# EAGLE design Prototype1 (EAGLE 9.5.2)
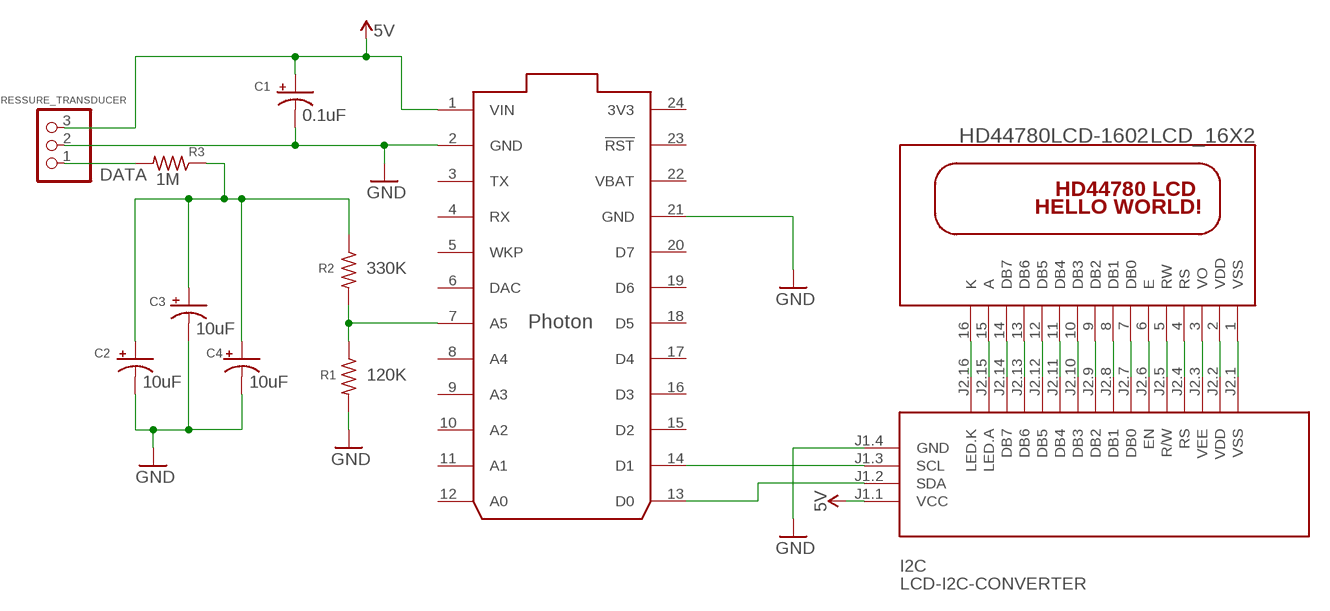
[diagram p0: schematic, sheet 1]

## Parts
C1  0.1uF  CPOL-USE2.5-7  [E2,5-7]
C2  10uF  CPOL-USE2.5-5  [E2,5-5]
C3  10uF  CPOL-USE2.5-5  [E2,5-5]
C4  10uF  CPOL-USE2.5-5  [E2,5-5]
I2C  LCD-I2C-CONVERTER  [LCD-I2C-CONVERTER]
LCD_16X2  HD44780LCD-1602  [LCD1602]
PHOTON  PHOTON_WITH_HEADERS  [PHOTON]
PRESSURE_TRANSDUCER  PINHD-1X3  [1X03]
R1  120K  R-US_0207/10  [0207/10]
R2  330K  R-US_0207/10  [0207/10]
R3  1M  R-US_0207/10  [0207/10]

## Nets
5V: C1.+ I2C.J1.1(VCC) PHOTON.1(VIN) PRESSURE_TRANSDUCER.3
DATA: C2.+ C3.+ C4.+ R2.1 R3.1
GND: C1.- C2.- C3.- C4.- I2C.J1.4(GND) PHOTON.2(GND) PHOTON.21(GND) PRESSURE_TRANSDUCER.2 R1.2
N$1: PHOTON.7(A5) R1.1 R2.2
N$3: I2C.J2.4(RS) I2C.J2.14(DB7) LCD_16X2.4(RS) LCD_16X2.14(DB7)
N$4: I2C.J2.5(R/W) I2C.J2.15(LED.A) LCD_16X2.5(RW) LCD_16X2.15(A)
N$5: I2C.J2.3(VEE) LCD_16X2.3(VO)
N$6: I2C.J2.7(DB0) LCD_16X2.7(DB0)
N$7: I2C.J2.8(DB1) LCD_16X2.8(DB1)
N$8: I2C.J2.9(DB2) LCD_16X2.9(DB2)
N$9: I2C.J2.10(DB3) LCD_16X2.10(DB3)
N$10: I2C.J2.11(DB4) LCD_16X2.11(DB4)
N$11: I2C.J2.12(DB5) LCD_16X2.12(DB5)
N$12: I2C.J2.13(DB6) LCD_16X2.13(DB6)
N$13: I2C.J2.16(LED.K) LCD_16X2.16(K)
N$14: I2C.J2.6(EN) LCD_16X2.6(E)
N$15: I2C.J1.2(SDA) PHOTON.13(D0)
N$17: I2C.J1.3(SCL) PHOTON.14(D1)
N$18: PRESSURE_TRANSDUCER.1 R3.2
VDD: I2C.J2.2(VDD) LCD_16X2.2(VDD)
VSS: I2C.J2.1(VSS) LCD_16X2.1(VSS)
Unconnected: PHOTON.3(TX) PHOTON.4(RX) PHOTON.5(WKP) PHOTON.6(DAC) PHOTON.8(A4) PHOTON.9(A3) PHOTON.10(A2) PHOTON.11(A1) PHOTON.12(A0) PHOTON.15(D2) PHOTON.16(D3) PHOTON.17(D4) PHOTON.18(D5) PHOTON.19(D6) PHOTON.20(D7) PHOTON.23(!RST)

## Power pins joined to a net without a drawn wire
3V3: PHOTON.24(3V3)
VBAT: PHOTON.22(VBAT)

## Library data of the parts
C1-C4 = adafruit:CPOL-US: POLARIZED CAPACITOR, American symbol
I2C = diy-modules:LCD-I2C-CONVERTER: I2C Bus to 4-Bit Parallel LCD Interface with LED backlight driver
LCD_16X2 = adafruit:HD44780LCD: HD44780 LCD Standard character type LCDs, available in sizes from 8x1 to 40x4!
PHOTON = Particle-Devices:PHOTON: Particle Photon Wi-Fi through-hole development board footprint Product datasheet: here <https://docs.particle.io/datasheets/photon-(wifi)/photon-datasheet/> Design files: here <https://github.com/particle-iot/photon> Github : Particle devices library <https://github.com/particle-iot/hardware-libraries/tree/master/Eagle>
PRESSURE_TRANSDUCER = adafruit:PINHD-1X3: PIN HEADER
R1-R3 = adafruit:R-US_: RESISTOR, American symbol

## Board
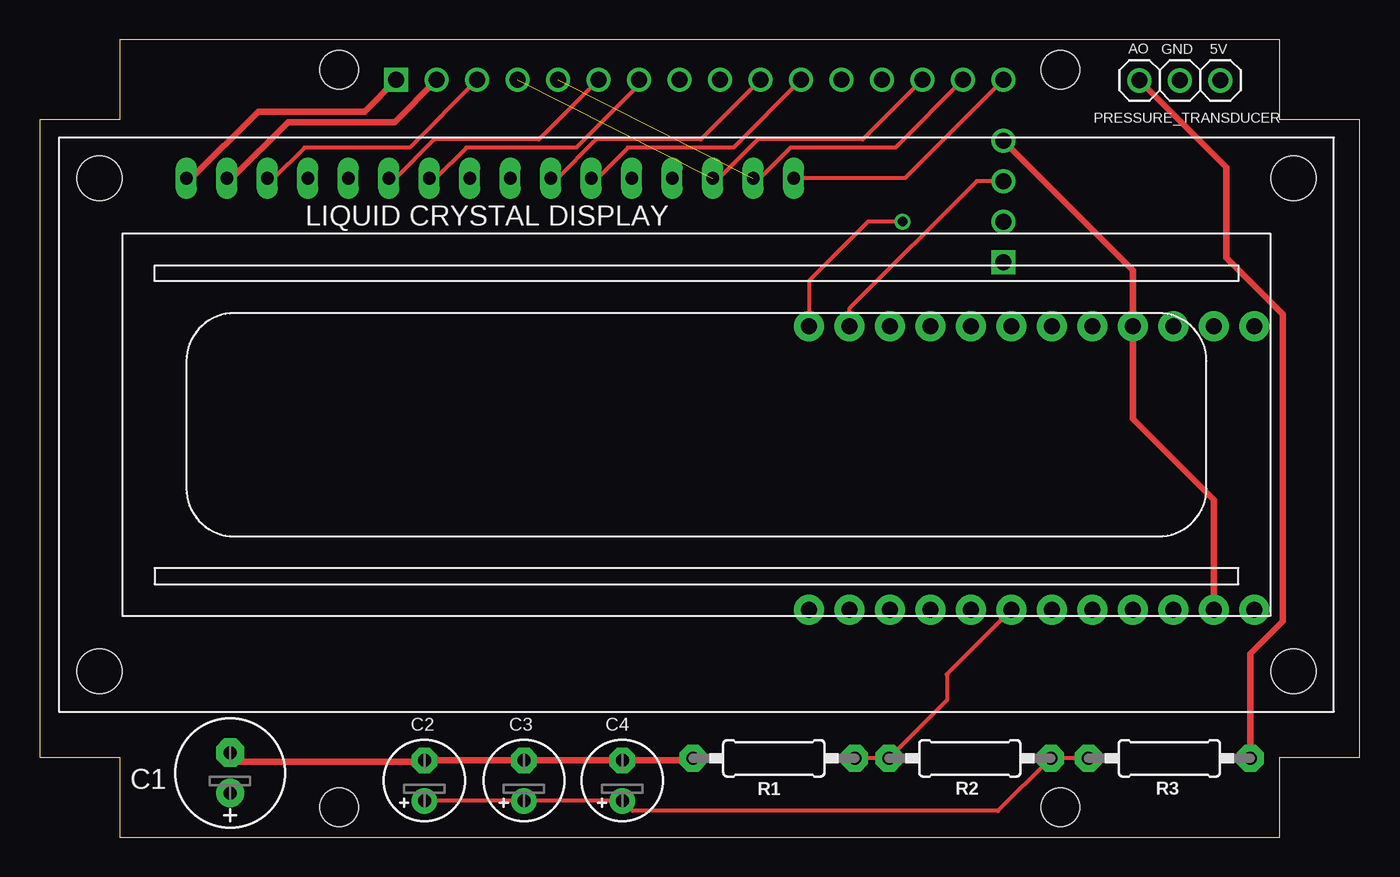
[diagram p1: board, top side]
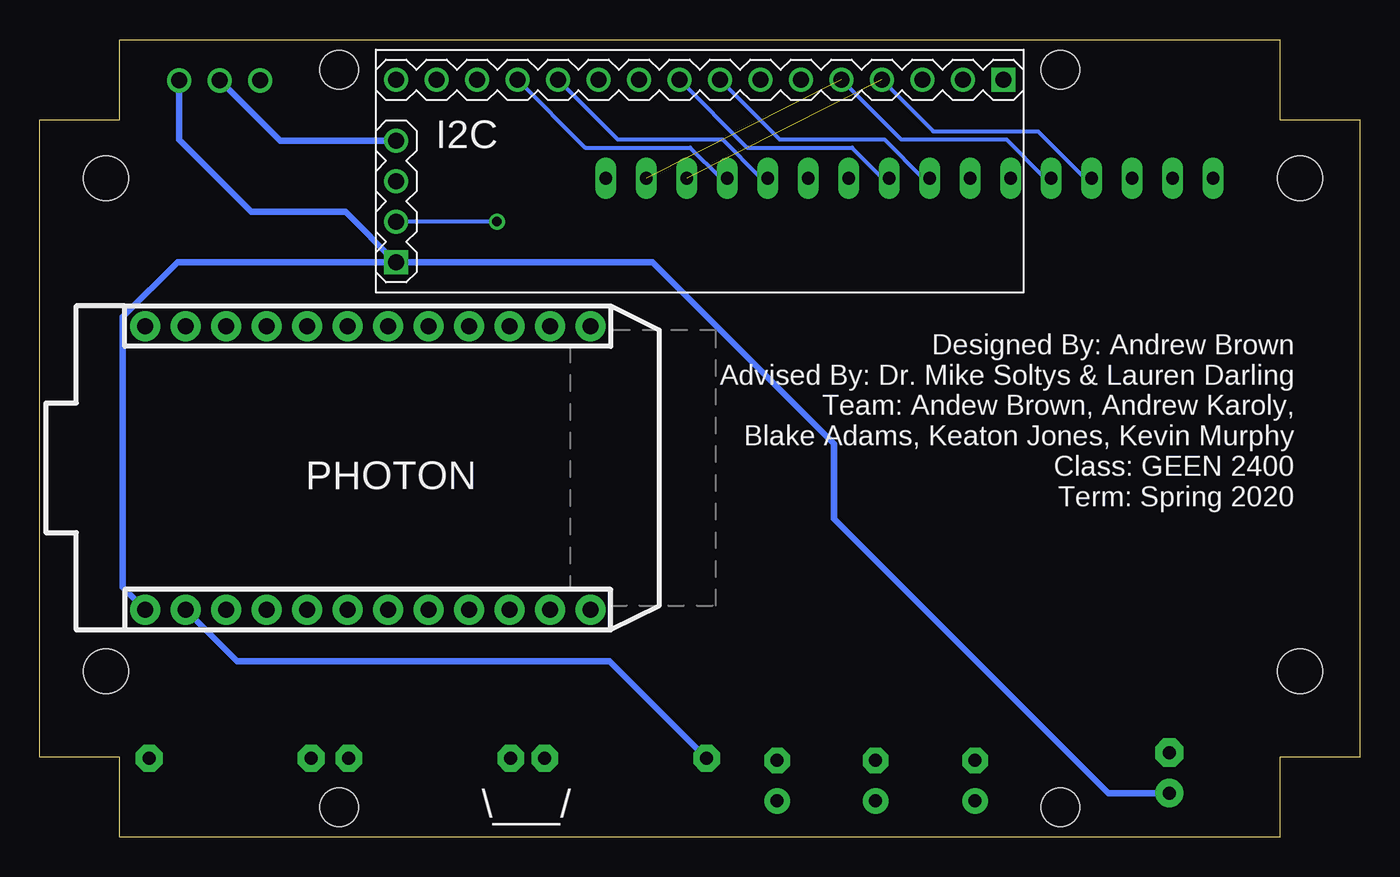
[diagram p2: board, bottom side, seen from below]

Size 82.8 x 50 mm. Coordinates in mm from the lower left corner, seen from the top.
Outline: 82.8,5 82.8,45 77.8,45 77.8,50 5,50 5,45 0,45 0,5.01 5,5.01 5,0 77.8,0 77.8,5 82.8,5
Copper layers (1*16): Top 0.035mm / dielectric 1.5mm / Bottom 0.035mm
Design rules "default *": minimum track width 10mil, minimum drill 0.6mm, track to track 10mil, track to pad 10mil, pad to pad 10mil, via to via 10mil, smd to smd 10mil, copper to edge 40mil, drill to drill 6mil, minimum pad ring 10mil, minimum via ring 8mil, stop-mask expansion 4mil, vias tented up to drill 0mil, thermal gap 10mil
Holes 2.41 mm at 18.79,1.88 18.79,48.11 64.02,48.11 64.02,1.88

### Footprints (pad centres in the part's own frame; a part is rotated, then mirrored left to right if it is on the bottom)
E2,5-7 = drill 0.813 pad 1.778: + -1.27,0 | drill 0.813 pad 1.778 octagon: - 1.27,0
E2,5-5 = drill 0.813 pad 1.6: + -1.27,0 | drill 0.813 pad 1.6 octagon: - 1.27,0
LCD-I2C-CONVERTER = drill 1 square: J1.1 -19.05,-5.08; J2.1 19.05,6.35 | drill 1: J1.2 -19.05,-2.54; J1.3 -19.05,0; J1.4 -19.05,2.54; J2.2 16.51,6.35; J2.3 13.97,6.35; J2.4 11.43,6.35; J2.5 8.89,6.35; J2.6 6.35,6.35; J2.7 3.81,6.35; J2.8 1.27,6.35; J2.9 -1.27,6.35; J2.10 -3.81,6.35; J2.11 -6.35,6.35; J2.12 -8.89,6.35; J2.13 -11.43,6.35; J2.14 -13.97,6.35; J2.15 -16.51,6.35; J2.16 -19.05,6.35
LCD1602 = drill 0.8 long: 1 8,33.46; 2 10.54,33.46; 3 13.08,33.46; 4 15.62,33.46; 5 18.16,33.46; 6 20.7,33.46; 7 23.24,33.46; 8 25.78,33.46; 9 28.32,33.46; 10 30.86,33.46; 11 33.4,33.46; 12 35.94,33.46; 13 38.48,33.46; 14 41.02,33.46; 15 43.56,33.46; 16 46.1,33.46 | hole 2.8: 2.54,2.54; 2.54,33.46; 77.46,33.46; 77.46,2.54
PHOTON = drill 1.016 pad 1.88: 1 1.27,33.02; 2 1.27,30.48; 3 1.27,27.94; 4 1.27,25.4; 5 1.27,22.86; 6 1.27,20.32; 7 1.27,17.78; 8 1.27,15.24; 9 1.27,12.7; 10 1.27,10.16; 11 1.27,7.62; 12 1.27,5.08; 13 19.05,5.08; 14 19.05,7.62; 15 19.05,10.16; 16 19.05,12.7; 17 19.05,15.24; 18 19.05,17.78; 19 19.05,20.32; 20 19.05,22.86; 21 19.05,25.4; 22 19.05,27.94; 23 19.05,30.48; 24 19.05,33.02
1X03 = drill 1.016: 1 -2.54,0; 2 0,0; 3 2.54,0
0207/10 = drill 0.813 pad 1.676 octagon: 1 -5.08,0; 2 5.08,0

### Placement (x,y rotation side)
C1  11.94,4.03 90 top
C2  24.13,3.54 90 top
C3  30.38,3.54 90 top
C4  36.55,3.54 90 top
I2C  41.4,41.14 0 bottom
LCD_16X2  1.19,7.86 0 top
PHOTON  43.18,12.99 90 bottom
PRESSURE_TRANSDUCER  71.53,47.46 0 top
R1  46.05,4.94 180 top
R2  58.34,4.94 180 top
R3  70.87,4.94 0 top

### Tracks (layer width: path | path; a pad name or v marks a point on that pad's centre or on a via)
5V
  Bottom 0.406: I2C.J1.1 44.76,36.05 44.75,36.05 44.36,36.05 32.99,24.68 32.99,19.98 15.77,2.76 C1.+ | PHOTON.1 77.6,15.66 77.6,32.62 74.16,36.05 I2C.J1.1 | PRESSURE_TRANSDUCER.3 74.07,43.73 69.55,39.2 63.63,39.2 60.48,36.05 I2C.J1.1
DATA
  Top 0.254: C2.+ C3.+ C4.+ 37.19,1.64 60.12,1.64 R2.1 R3.1
GND
  Top 0.406: R1.2 40.84,4.81 C4.- C3.- C2.- 24.03,4.71 12.52,4.71 C1.- | I2C.J1.4 68.58,35.55 PHOTON.21 68.58,26.25 73.66,21.17 PHOTON.2
  Bottom 0.406: PHOTON.2 70.42,11.02 47.05,11.02 R1.2 | PRESSURE_TRANSDUCER.2 67.74,43.67 I2C.J1.4
N$1
  Top 0.254: R1.1 R2.2 56.9,8.57 56.9,10.2 PHOTON.7
N$3  (1 unrouted)
  Top 0.254: I2C.J2.14 51.64,43.75 45.05,43.75 42.62,41.32 LCD_16X2.14
  Bottom 0.254: I2C.J2.4 26.75,44.26 20.17,44.26 17.24,41.32 LCD_16X2.4
N$4  (1 unrouted)
  Top 0.254: LCD_16X2.15 45.18,41.32 47.09,43.24 53.67,43.24 I2C.J2.15
  Bottom 0.254: I2C.J2.5 28.78,43.75 22.17,43.75 19.74,41.32 LCD_16X2.5
N$5
  Top 0.254: LCD_16X2.3 14.68,41.32 16.6,43.24 23.19,43.24 I2C.J2.3
N$6
  Top 0.254: I2C.J2.7 37.59,47.18 33.66,43.24 26.76,43.24 24.84,41.32 LCD_16X2.7
N$7
  Bottom 0.254: I2C.J2.8 36.4,43.75 29.83,43.75 27.4,41.32 LCD_16X2.8
N$8
  Bottom 0.254: I2C.J2.9 38.43,43.24 31.85,43.24 29.93,41.32 LCD_16X2.9
N$9
  Top 0.254: I2C.J2.10 41.48,43.75 34.91,43.75 32.48,41.32 LCD_16X2.10
N$10
  Top 0.254: I2C.J2.11 43.51,43.24 36.9,43.24 34.98,41.32 LCD_16X2.11
N$11
  Bottom 0.254: I2C.J2.12 46.56,43.75 39.99,43.75 37.56,41.32 LCD_16X2.12
N$12
  Bottom 0.254: I2C.J2.13 48.59,43.24 42,43.24 40.08,41.32 LCD_16X2.13
N$13
  Top 0.254: I2C.J2.16 54.29,41.32 LCD_16X2.16
N$14
  Top 0.254: I2C.J2.6 31.32,43.75 24.74,43.75 22.31,41.32 LCD_16X2.6
N$15  (via drill 0.6)
  Top 0.254: v54.13,38.59 51.97,38.59 48.26,34.89 PHOTON.13
  Bottom 0.254: v54.13,38.59 I2C.J1.2
N$17
  Top 0.254: I2C.J1.3 58.78,41.13 50.8,33.16 PHOTON.14
N$18
  Top 0.406: R3.2 75.95,11.5 77.98,13.53 77.98,32.8 74.45,36.33 74.45,42 PRESSURE_TRANSDUCER.1
VDD
  Top 0.406: I2C.J2.2 22.25,44.84 15.57,44.84 12.05,41.32 LCD_16X2.2
VSS
  Top 0.406: I2C.J2.1 20.37,45.5 13.69,45.5 9.51,41.32 LCD_16X2.1

### Text on the board
tNames: AO | GND | 5V | LIQUID CRYSTAL DISPLAY
bNames: Designed By: Andrew Brown / Advised By: Dr. Mike Soltys & Lauren Darling / Team: Andew Brown, Andrew Karoly, / Blake Adams, Keaton Jones, Kevin Murphy / Class: GEEN 2400 / Term: Spring 2020 | \\___/